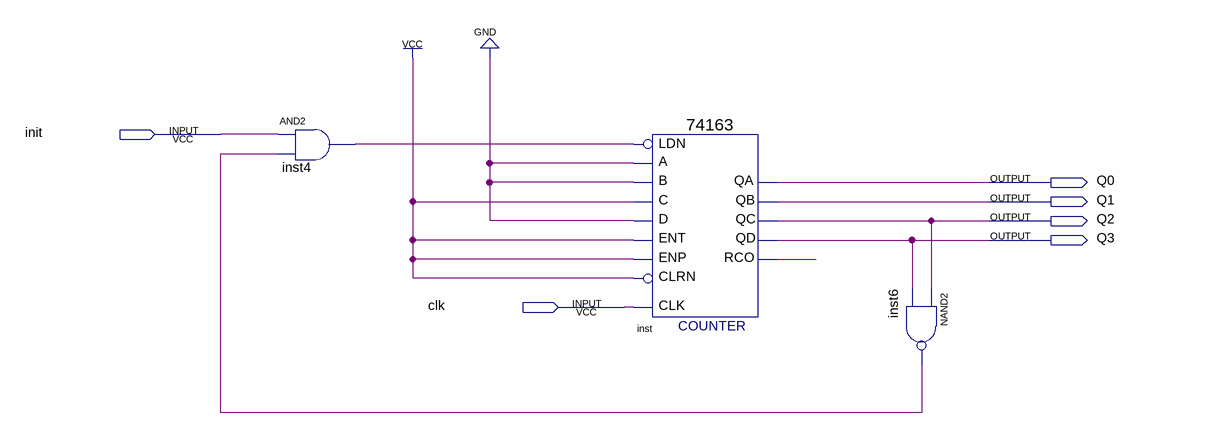
[diagram p0: schematic sheet]
// Quartus schematic SpecialCount4.bdf as structural Verilog: 3 symbols, 6 pins
module SpecialCount4 (
  input  init,
  input  clk,
  output Q0,
  output Q1,
  output Q2,
  output Q3
);

  wire inst4_out, inst6_out, inst_rco;

  and inst4 (inst4_out, init, inst6_out);
  \74163  inst (
    .C(1'b1), .B(1'b0), .A(1'b0), .ENT(1'b1), .D(1'b0), .CLRN(1'b1), .CLK(clk), .ENP(1'b1), .LDN(inst4_out),
    .QA(Q0), .QB(Q1), .QC(Q2), .QD(Q3), .RCO(inst_rco));
  nand inst6 (inst6_out, Q2, Q3);
endmodule
